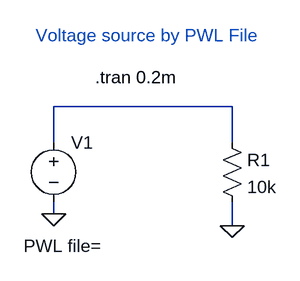
[diagram p0: schematic LTspice 02-6 PWL file.asc]
LTspice 02-6 PWL file.asc, the LTspice schematic file:
Version 4
SHEET 1 1076 680
WIRE 320 64 80 64
WIRE 80 112 80 64
WIRE 320 112 320 64
WIRE 80 208 80 192
WIRE 320 224 320 192
FLAG 80 208 0
FLAG 320 224 0
SYMBOL voltage 80 96 R0
WINDOW 3 -40 155 Left 2
WINDOW 123 0 0 Left 2
WINDOW 39 0 0 Left 2
SYMATTR Value PWL file=
SYMATTR InstName V1
SYMBOL res 304 96 R0
SYMATTR InstName R1
SYMATTR Value 10k
TEXT 136 24 Left 2 !.tran 0.2m
TEXT 56 -32 Left 2 ;Voltage source by PWL File

The netlist it stands for:
* LTspice 02-6 PWL file.asc
V1 N001 0 PWL file=
R1 N001 0 10k
.tran 0.2m
* Voltage source by PWL File
.backanno
.end